# Altium schematic sheet mini_drone.SchDoc: Mini Drone
size A4; Date: 01/07/2025; CompanyName: IEEE; DrawnBy: Maymoun Jabnouni; Revision: V 1.0; SheetNumber: 1; SheetTotal: 1; SPICEModelCacheRREEQEPK: <root> / <DocumentId>RREEQEPK</DocumentId> / </root>; Time: 15:34
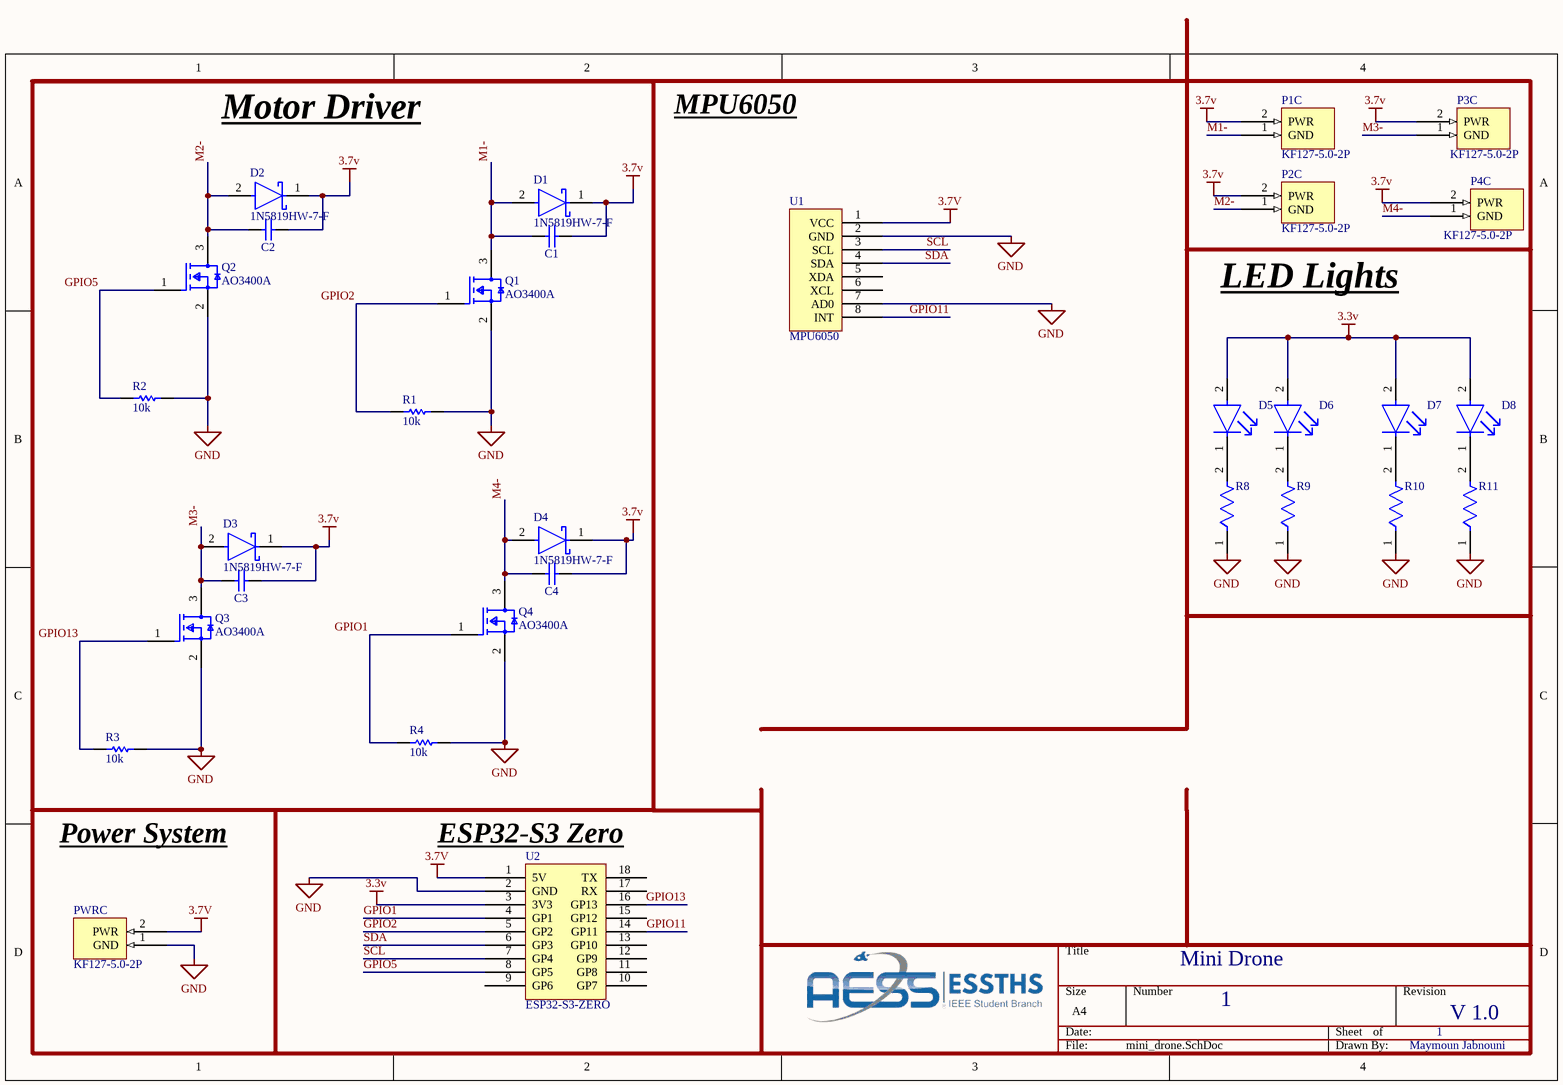
[diagram p0: mini_drone.SchDoc]

## Parts
C1  GRM188R71C104KA01D  [MURA-0603_H_0.9_M]  (value not drawn)
C2  GRM188R71C104KA01D  [MURA-0603_H_0.9_M]  (value not drawn)
C3  GRM188R71C104KA01D  [MURA-0603_H_0.9_M]  (value not drawn)
C4  GRM188R71C104KA01D  [MURA-0603_H_0.9_M]  (value not drawn)
D1  1N5819HW-7-F  [FP-SOD123-IPC_A]
D2  1N5819HW-7-F  [FP-SOD123-IPC_A]
D3  1N5819HW-7-F  [FP-SOD123-IPC_A]
D4  1N5819HW-7-F  [FP-SOD123-IPC_A]
D5  APT3216LSECK/J4-PRV  [FP-APT3216LSECK-J4-PRV-MFG]  (value not drawn)
D6  APT3216LSECK/J4-PRV  [FP-APT3216LSECK-J4-PRV-MFG]  (value not drawn)
D7  APT3216LSECK/J4-PRV  [FP-APT3216LSECK-J4-PRV-MFG]  (value not drawn)
D8  APT3216LSECK/J4-PRV  [FP-APT3216LSECK-J4-PRV-MFG]  (value not drawn)
P1  KF127-5.0-2P  [CONNECTOR]  (part C of 3)
P2  KF127-5.0-2P  [CONNECTOR]  (part C of 3)
P3  KF127-5.0-2P  [CONNECTOR]  (part C of 3)
P4  KF127-5.0-2P  [CONNECTOR]  (part C of 3)
PWR  KF127-5.0-2P  [CONNECTOR]  (part C of 3)
Q1  AO3400A  [FP-SOT23-MFG]
Q2  AO3400A  [FP-SOT23-MFG]
Q3  AO3400A  [FP-SOT23-MFG]
Q4  AO3400A  [FP-SOT23-MFG]
R1  value 10k  [RESC1608X55X25ML10T15]  (hidden comment: Resistor 0R +/- 5% 0603 100 mW)
R2  value 10k  [RESC1608X55X25ML10T15]  (hidden comment: Resistor 0R +/- 5% 0603 100 mW)
R3  value 10k  [RESC1608X55X25ML10T15]  (hidden comment: Resistor 0R +/- 5% 0603 100 mW)
R4  value 10k  [RESC1608X55X25ML10T15]  (hidden comment: Resistor 0R +/- 5% 0603 100 mW)
R8  RC0603JR-0722RL  [FP-RC0603-0_55-IPC_C]  (value not drawn)
R9  RC0603JR-0722RL  [FP-RC0603-0_55-IPC_C]  (value not drawn)
R10  RC0603JR-0722RL  [FP-RC0603-0_55-IPC_C]  (value not drawn)
R11  RC0603JR-0722RL  [FP-RC0603-0_55-IPC_C]  (value not drawn)
U1  MPU6050  [MPU6050]
U2  ESP32-S3-ZERO  [ESP32-S3-ZERO-DIP]

## Nets
3.3v: D5.2(A) D6.2(A) D7.2(A) D8.2(A) U2.3(3V3)
3.7v: C1.2 C2.2 C3.2 C4.2 D1.1(C) D2.1(C) D3.1(C) D4.1(C) P1.2(PWR) P2.2(PWR) P3.2(PWR) P4.2(PWR) PWR.2(PWR) U1.1(VCC) U2.1(5V)
GND: PWR.1(GND) Q1.2(S) Q2.2(S) Q3.2(S) Q4.2(S) R1.2 R2.2 R3.2 R4.2 R8.1 R9.1 R10.1 R11.1 U1.2(GND) U1.7(AD0) U2.2(GND)
GPIO1: Q4.1(G) R4.1 U2.4(GP1)
GPIO2: Q1.1(G) R1.1 U2.5(GP2)
GPIO5: Q2.1(G) R2.1 U2.8(GP5)
GPIO11: U1.8(INT) U2.14(GP11)
GPIO13: Q3.1(G) R3.1 U2.16(GP13)
M1-: C1.1 D1.2(A) P1.1(GND) Q1.3(D)
M2-: C2.1 D2.2(A) P2.1(GND) Q2.3(D)
M3-: C3.1 D3.2(A) P3.1(GND) Q3.3(D)
M4-: C4.1 D4.2(A) P4.1(GND) Q4.3(D)
SCL: U1.3(SCL) U2.7(GP4)
SDA: U1.4(SDA) U2.6(GP3)
NetD5_1: D5.1(C) R8.2
NetD6_1: D6.1(C) R9.2
NetD7_1: D7.1(C) R10.2
NetD8_1: D8.1(C) R11.2

Not connected (* = marked no-connect by the designer): U1 5(XDA) 6(XCL); U2 9(GP6) 10(GP7) 11(GP8) 12(GP9) 13(GP10) 15(GP12) 17(RX) 18(TX)

## Notes on the sheet
- Motor Driver
- MPU6050
- (near P2) LED Lights
- Power System
- (near U2) ESP32-S3 Zero

## Library data of the parts
C1-C4 = CMP-2000-05253-1: CAP, Ceramic, 0.1 uF, 10%, 16 V, 0603, RoHS, Tape and Reel; Manufacturer: Murata; Capacitance - pF: 100000pF; Case Length: 1.6mm; Voltage Rating DC: 16V; Brand: MurataElectronics; Temperature Coefficient / Code: +/-15%; Case Width: 0.8mm; Type: GeneralPurposeMLCC; Capacitance: 0.1uF; Dielectric: X7R; Capacitance - nF: 100nF; Product Category: MultilayerCeramicCapacitorsMLCC-SMD/SMT; Datasheet URL: https://datasheet.ciiva.com/29202/451467-da-01-en-vs-kondensator-0603-29202287.pdf; Termination Style: SMD/SMT; Operating Temperature Range: -55Cto+125C; Case Code - in: 0603; Datasheet Version: Dec-10; Dimensions: 0.8mmWx1.6mmLx0.8mmH; RoHS: Details; Case Code - mm: 1608; Product: GeneralTypeMLCCs; Voltage Rating: 16V; Package / Case: 0603(1608metric); Factory Pack Quantity: 4000; Packaging: Reel; Maximum Operating Temperature: +125C; Manufacturer URL: http://www.murata.com/; Case Height: 0.8mm; Minimum Operating Temperature: -55C; Series: GRM; Tolerance: 10%
D1-D4 = CMP-0303-00003-3: DIODE SCHOTTKY 40V 1A SOD123; Forward Voltage: 450mV; Capacitance: 110pF; Max Forward Surge Current (Ifsm): 25A; Peak Reverse Current: 50uA; Polarity: Standard; Element Configuration: Single; Max Power Dissipation: 450mW; Min Operating Temperature: -65°C; Package Quantity: 3000; Contact Plating: Tin; Weight: 0.000353oz; Max Repetitive Reverse Voltage (Vrrm): 40V; Max Reverse Voltage (DC): 40V; Height: 1.25mm; Average Rectified Current: 1A; Width: 1.7mm; Case/Package: SOD-123-2; Lead Free: Lead Free; Max Operating Temperature: 125°C; Current Rating: 1A; Termination: SMD/SMT; Forward Current: 1A; Radiation Hardening: No; Number of Pins: 2; Length: 2.85mm; Voltage Rating (DC): 40V; REACH SVHC: No SVHC; Peak Non-Repetitive Surge Current: 25A; Packaging: Tape and Reel; Output Current: 1A
D5-D8 = CMP-44529-000067-1: LED ORANGE CLEAR 2SMD; Lens Color: Colorless; Viewing Angle: 120°; Test Current: 2mA; Forward Voltage: 1.8V; Luminous Intensity: 50mcd; Dominant Wavelength: 605nm; Case/Package: 1206; Length: 3.2mm; Width: 1.6mm; Case Code (Imperial): 1206; Mount: Surface Mount; RoHS Compliant: Yes; Lens Transparency: Clear; Case Code (Metric): 3216; Packaging: Tape and Reel; Height: 0.75mm; Color: Orange
P1-P4 PWR = connector
Q1-Q4 = CMP-83955-000006-1: MOSFET N-CH 30V 5.7A SOT23; Input Capacitance: 630pF; Number of Elements: 1; Rds On Max: 26.5mR; Max Power Dissipation: 1.4W; Gate to Source Voltage (Vgs): 12V; Min Operating Temperature: -55°C; Lead Free: Lead Free; Number of Pins: 3; Drain to Source Voltage (Vdss): 30V; Case/Package: SOT-23; Mount: Surface Mount; Continuous Drain Current (ID): 5.7A; Radiation Hardening: No; Packaging: Tape and Reel; Max Operating Temperature: 150°C; Power Dissipation: 1.4W
R1-R4 = CMP-009-00006-5: Chip Resistor, 0 Ohm, 0.1 W, -55 to 155 degC, 0603 (1608 Metric); Power: 100mW; Voltage Rating: 50V; Max Operating Temperature: 155°C; RoHS Compliant: True; Mounting Technology: SM; Case/Package: 0603; Min Operating Temperature: -55°C; Tolerance: 5%; Pins: 2
R8-R11 = CMP-03412-037819-1: RES SMD 22 OHM 5% 1/10W 0603; Temperature Coefficient: 100ppm/°C; Max Power Dissipation: 100mW; Voltage Rating: 50V; Resistance: 22R; Length: 1.6mm; Tolerance: 5%; Resistance Tolerance: 5%; Number of Terminations: 2; Construction: Rectangular; Min Operating Temperature: -55°C; Lead Free: Lead Free; Width: 0.8mm; Case Code (Imperial): 0603; Voltage Rating (DC): 50V; Case/Package: 0603; Features: Moisture Resistant; REACH SVHC: No SVHC; Military Standard: Not; RoHS Compliant: Yes; Max Operating Temperature: 155°C; Number of Pins: 2; Termination: SMD/SMT; Case Code (Metric): 1608; Packaging: Tape and Reel; Resistor Type: Thick Film; Depth: 0.8mm; Size Code: 0603; Power Rating: 100mW; Series: RC
U2 = esp32s3-zero